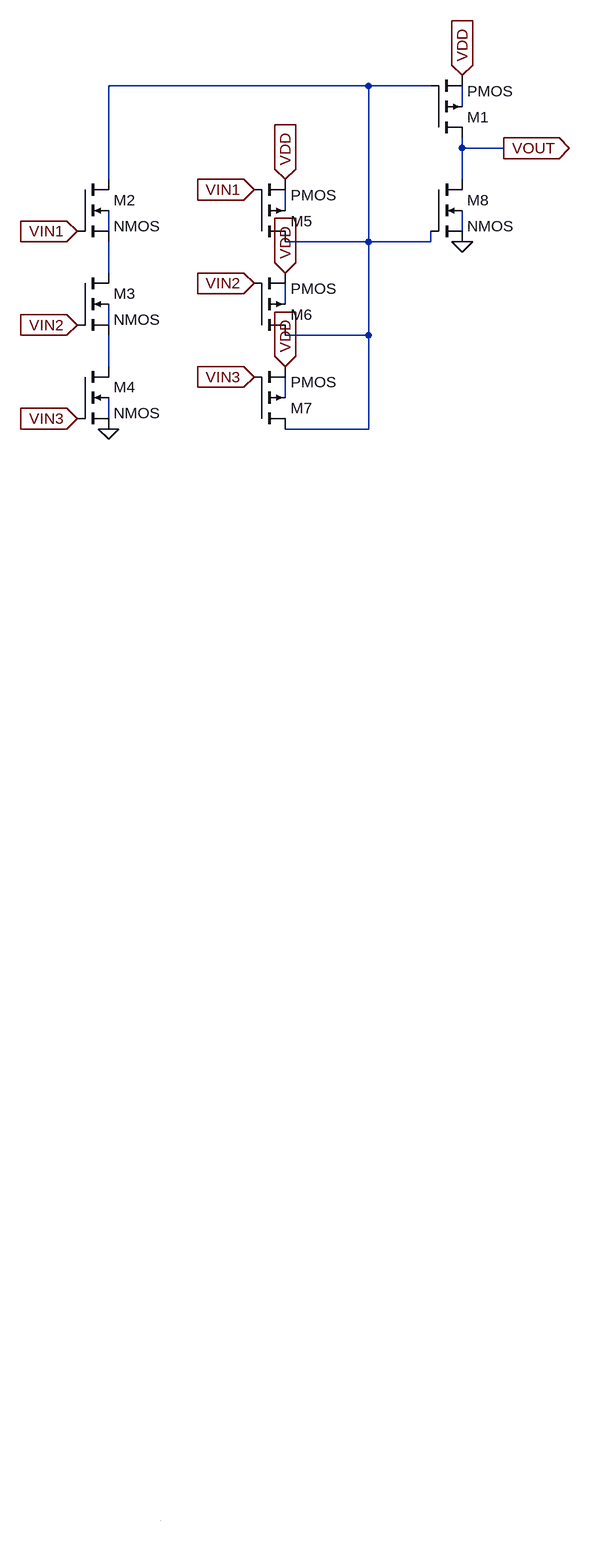
[diagram p0: schematic and3.asc]
and3.asc, the LTspice schematic file:
Version 4
SHEET 1 880 680
WIRE 320 -2208 -80 -2208
WIRE 416 -2208 320 -2208
WIRE 464 -2176 464 -2208
WIRE 464 -2112 464 -2128
WIRE 528 -2112 464 -2112
WIRE -80 -2064 -80 -2208
WIRE 464 -2064 464 -2112
WIRE 192 -2016 192 -2048
WIRE -80 -1984 -80 -2016
WIRE 464 -1984 464 -2016
WIRE 320 -1968 320 -2208
WIRE 320 -1968 192 -1968
WIRE 416 -1968 416 -1984
WIRE 416 -1968 320 -1968
WIRE -80 -1920 -80 -1968
WIRE 192 -1872 192 -1904
WIRE -80 -1840 -80 -1872
WIRE 320 -1824 320 -1968
WIRE 320 -1824 192 -1824
WIRE -80 -1776 -80 -1824
WIRE 192 -1728 192 -1760
WIRE -80 -1696 -80 -1728
WIRE 320 -1680 320 -1824
WIRE 320 -1680 192 -1680
WIRE 0 0 0 0
FLAG -80 -1680 0
FLAG -128 -1984 VIN1
IOPIN -128 -1984 In
FLAG -128 -1840 VIN2
IOPIN -128 -1840 In
FLAG -128 -1696 VIN3
IOPIN -128 -1696 In
FLAG 464 -2224 VDD
IOPIN 464 -2224 In
FLAG 528 -2112 VOUT
IOPIN 528 -2112 Out
FLAG 464 -1968 0
FLAG 144 -2048 VIN1
IOPIN 144 -2048 In
FLAG 144 -1904 VIN2
IOPIN 144 -1904 In
FLAG 144 -1760 VIN3
IOPIN 144 -1760 In
FLAG 192 -2064 VDD
IOPIN 192 -2064 In
FLAG 192 -1920 VDD
IOPIN 192 -1920 In
FLAG 192 -1776 VDD
IOPIN 192 -1776 In
SYMBOL nmos4 -128 -2064 R0
SYMATTR InstName M2
SYMATTR Value2 l=90n w=200n
SYMBOL nmos4 -128 -1920 R0
SYMATTR InstName M3
SYMATTR Value2 l=90n w=200n
SYMBOL nmos4 -128 -1776 R0
SYMATTR InstName M4
SYMATTR Value2 l=90n w=200n
SYMBOL pmos4 416 -2128 M180
SYMATTR InstName M1
SYMATTR Value2 l=90n w=400n
SYMBOL pmos4 144 -1968 M180
SYMATTR InstName M5
SYMATTR Value2 l=90n w=400n
SYMBOL pmos4 144 -1824 M180
SYMATTR InstName M6
SYMATTR Value2 l=90n w=400n
SYMBOL pmos4 144 -1680 M180
SYMATTR InstName M7
SYMATTR Value2 l=90n w=400n
SYMBOL nmos4 416 -2064 R0
SYMATTR InstName M8
SYMATTR Value2 l=90n w=200n

The netlist it stands for:
* and3.asc
M2 N001 VIN1 N006 N004 NMOS l=90n w=200n
M3 N006 VIN2 N009 N008 NMOS l=90n w=200n
M4 N009 VIN3 0 N011 NMOS l=90n w=200n
M1 VOUT N001 VDD N002 PMOS l=90n w=400n
M5 N001 VIN1 VDD N003 PMOS l=90n w=400n
M6 N001 VIN2 VDD N007 PMOS l=90n w=400n
M7 N001 VIN3 VDD N010 PMOS l=90n w=400n
M8 VOUT N001 0 N005 NMOS l=90n w=200n
.model NMOS NMOS
.model PMOS PMOS
.lib standard.mos
.backanno
.end